# Altium schematic sheet PreCharge.SchDoc: MSXII - PreCharge and Discharge controller
size Legal; DrawnBy: Taiping Li
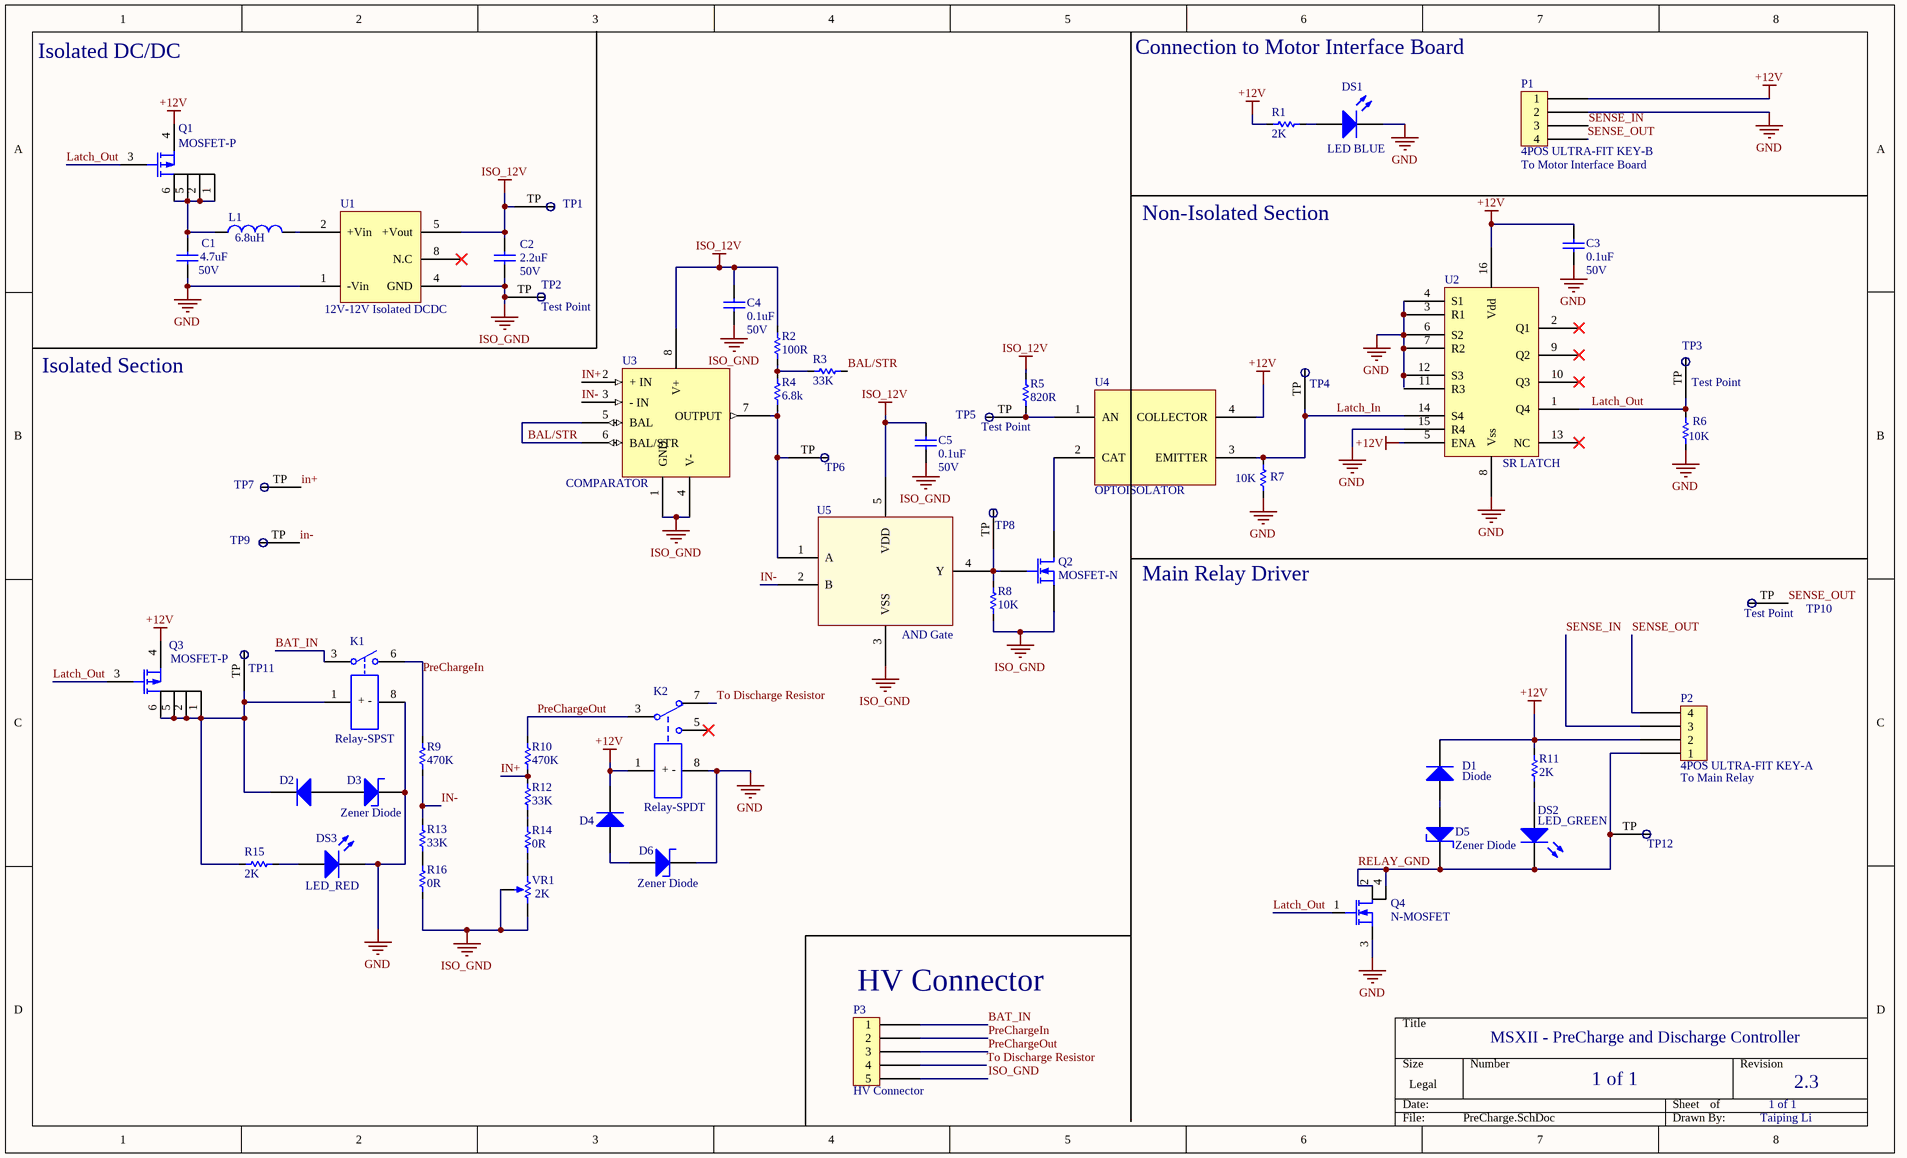
[diagram p0: PreCharge.SchDoc]

## Parts
C1  4.7uF  Voltage: 50V  [0805]
C2  2.2uF  Voltage: 50V  [CAPC1608X06N]
C3  0.1uF  Voltage: 50V  [CAPC1608X06N]
C4  0.1uF  Voltage: 50V  [CAPC1608X06N]
C5  0.1uF  Voltage: 50V  [CAPC1608X06N]
D1  Diode  [DO-214AA Diode]
D2  Diode  [DO-214AA Diode]  (value not drawn)
D3  Zener Diode  [DO-214AA Diode]
D4  Diode  [DO-214AA Diode]  (value not drawn)
D5  Zener Diode  [DO-214AA Diode]
D6  Zener Diode  [DO-214AA Diode]
DS1  LED BLUE  [LED_0603]
DS2  LED_GREEN  [LED_0603]
DS3  LED_RED  [LED_0603]
K1  Relay-SPST  [RELAY-SPST]
K2  Relay-SPDT  [RELAY_SPDT]
L1  6.8uH  [NLFV32T-6R8M-EF/IND 6.8uH]
P1  4POS ULTRA-FIT KEY-B  [4 POS ULTRA-FIT]
P2  4POS ULTRA-FIT KEY-A  [4 POS ULTRA-FIT]
P3  HV Connector  [5 POS ULTRA-FIT]
Q1  MOSFET-P  [P-MOSFET]
Q2  MOSFET-N  [N-CH MOSFET SOT-23]
Q3  MOSFET-P  [P-MOSFET]
Q4  N-MOSFET  [BUK9880 N-MOSFET 7A]
R1  2K  [RES_0603]
R2  100R  [RESC1608X06N]
R3  33K  [RESC1608X06N]
R4  6.8k  [RESC1608X06N]
R5  value 820R  [RESC1608X06N]  (hidden comment: 820 Ohm)
R6  10K  [RES_0603]
R7  10K  [RES_0603]
R8  10K  [RESC1608X06N]
R9  470K  [RES_0603]
R10  470K  [RES_0603]
R11  2K  [RES_0603]
R12  33K  [RES_0603]
R13  33K  [RES_0603]
R14  0R  [RESC1608X06N]
R15  2K  [RES_0603]
R16  0R  [RESC1608X06N]
TP1  Test Point  [Test Point]  (value not drawn)
TP2  Test Point  [Test Point]
TP3  Test Point  [Test Point]
TP4  Test Point  [Test Point]  (value not drawn)
TP5  Test Point  [Test Point]
TP6  Test Point  [Test Point]  (value not drawn)
TP7  Test Point  [Test Point]  (value not drawn)
TP8  Test Point  [Test Point]  (value not drawn)
TP9  Test Point  [Test Point]  (value not drawn)
TP10  Test Point  [Test Point]
TP11  Test Point  [Test Point]  (value not drawn)
TP12  Test Point  [Test Point]  (value not drawn)
U1  12V-12V Isolated DCDC  [1470-2950-1-ND/Isolated DCDC]
U2  SR LATCH  [CD4043BDR-16SOIC]
U3  COMPARATOR  [SOIC8]
U4  OPTOISOLATOR  [FOD817DS OPTOISOLATOR]
U5  AND Gate  [2-Input AND Gate]
VR1  value 2K  [20K POT]  (hidden comment: 2k 0.25W Pot)

## Nets
+12V: C3.2 D1.2(K) D4.2(K) K2.1(+) P1.1 P2.2 Q1.4(S) Q3.4(S) R1.2 R11.1 U2.5(ENA) U2.16(Vdd) U4.4(COLLECTOR)
GND: C1.1 C3.1 D3.2(K) D6.2(K) DS1.2(K) DS3.2(K) K1.8(-) K2.8(-) P1.2 Q4.3(S) R6.1 R7.1 U1.1(-Vin) U2.3(R1) U2.4(S1) U2.6(S2) U2.7(R2) U2.8(Vss) U2.12(S3) U2.15(R4)
ISO_12V: C2.2 C4.2 C5.2 R2.2 R5.2 TP1.TP U1.5(+Vout) U3.8(V+) U5.5(VDD)
ISO_GND: C2.1 C4.1 C5.1 P3.5 Q2.2(S) R8.1 R16.1 TP2.TP U1.4(GND) U3.1(GND) U3.4(V-) U5.3(VSS) VR1.2(TAP) VR1.3(BOT)
BAL/STR: R3.2 U3.5(BAL) U3.6(BAL/STR)
BAT_IN: K1.3 P3.1
in+: R10.1 R12.2 TP7.TP U3.2(+_IN)
in-: R9.1 R13.2 TP9.TP U3.3(-_IN) U5.2(B)
Latch_In: R7.2 TP4.TP U2.14(S4) U4.3(EMITTER)
Latch_Out: Q1.3(G) Q3.3(G) Q4.1(G) R6.2 TP3.TP U2.1(Q4)
PreChargeIn: K1.6 P3.2 R9.2
PreChargeOut: K2.3 P3.3 R10.2
RELAY_GND: D5.2(K) DS2.2(K) P2.1 Q4.2(D) Q4.4 TP12.TP
SENSE_IN: P1.3 P2.3
SENSE_OUT: P1.4 P2.4 TP10.TP
To Discharge Resistor: K2.7 P3.4
NetC1_2: C1.2 L1.1 Q1.1(D) Q1.2(D) Q1.5(D) Q1.6(D)
NetD1_1: D1.1(A) D5.1(A)
NetD2_1: D2.1(A) D3.1(A)
NetD2_2: D2.2(K) K1.1(+) Q3.1(D) Q3.2(D) Q3.5(D) Q3.6(D) R15.1 TP11.TP
NetD4_1: D4.1(A) D6.1(A)
NetDS1_1: DS1.1(A) R1.1
NetDS2_1: DS2.1(A) R11.2
NetDS3_1: DS3.1(A) R15.2
NetL1_2: L1.2 U1.2(+Vin)
NetQ2_1: Q2.1(G) R8.2 TP8.TP U5.4(Y)
NetQ2_3: Q2.3(D) U4.2(CAT)
NetR2_1: R2.1 R3.1 R4.2
NetR4_1: R4.1 TP6.TP U3.7(OUTPUT) U5.1(A)
NetR5_1: R5.1 TP5.TP U4.1(AN)
NetR12_1: R12.1 R14.2
NetR13_1: R13.1 R16.2
NetR14_1: R14.1 VR1.1(TOP)

Not connected (* = marked no-connect by the designer): K2 5*; U1 8(N.C)*; U2 2(Q1)* 9(Q2)* 10(Q3)* 11(R3) 13(NC)*

## Notes on the sheet
- Isolated DC/DC
- Connection to Motor Interface Board
- (near P1) To Motor Interface Board
- Non-Isolated Section
- Isolated Section
- Main Relay Driver
- (near P2) To Main Relay
- (near P3) HV Connector
- MSXII - PreCharge and Discharge Controller
- 1 of 1
- 2.3
- (in symbol Relay-SPDT) + -
- (in symbol Relay-SPST) + -

## Library data of the parts
C1 = CAP CER 4.7UF 25V 10% X5R 0603: 4.7µF ±10% 50V Ceramic Capacitor X5R 0805 (2012 Metric); Manufacturer: Murata Electronics North America; ManufacturerPartNumber: GRM188R61E475KE11D; Value: 4.7uF; Supplier 1: Digi-Key; Supplier 1 Part Number: CAP CER 4.7UF 50V X5R 0805
C2 = CAP CER 2.2UF 25V 10% 0603: CAP CER 2.2UF 50V X5R 0603; ManufacturerPartNumber: GRM188R61H225KE11D; Manufacturer: Murata Electronics North America; Supplier 1: Digi-Key; Value: 2.2uF; Supplier 1 Part Number: 490-10733-1-ND
C3-C5 = CAP CER 0.1UF 50V 10% X7R 0603: 0.10µF ±10% 50V Ceramic Capacitor X7R 0603 (1608 Metric); Manufacturer: AVX Corporation; ManufacturerPartNumber: 06035C104KAT2A; Value: 0.1uF; Supplier: Digi-Key; SupplierPartNumber: 478-5052-1-ND
D1 D2 D4 = Diode: Diode Schottky 40V 3A Surface Mount DO-214AA (SMB); Manufacture: Comchip Technology; Manufacture Part Number: CDBB340-HF; Voltage - Zener (Nom): 40; Voltage - Forward: 500mV @ 3A; Supplier 1: Digi-Key; Supplier Part Number 1: 641-1722-1-ND
D3 D5 D6 = Zener Diode: Zener Diode 16V 5W ±5% Surface Mount DO-214AA (SMB); Manufacture: Micro Commercial Co; Manufacture Part Number: SMBJ5353B-TP; Impedence (Max): 2.5 Ohm; Voltage - Forward: 1.2V @ 1A; Voltage - Zener (Nom): 16V; Power (Max): 5W; Supplier 1: Digi-Key; Supplier Part Number 1: SMBJ5353B-TPMSCT-ND
DS1 = LED_BLUE: LED BLUE CLEAR 0603 SMD; Manufacturer: Lite-On Inc.; Manufacturer Part Number: LTST-C193TBKT-5A; Forward Voltage: 2.8V; DC Foward Current: 20mA; Supplier 1 Part Number: 160-1827-1-ND; Color: Blue
DS2 = LED_GREEN: LED GREEN CLEAR 0603 SMD; Manufacturer: Lite-On Inc.; Manufacturer Part Number: LTST-C193KGKT-5A; Forward Voltage: 2.0V; DC Forward Current: 30mA; Package: 0603; Color: Green; Supplier 1: Digi-Key; Supplier 1 Part Number: 160-1828-1-ND
DS3 = LED_RED: Red LED 0603; Manufacture: Lite-On Inc.; Manufacture Part Number: LTST-C191KRKT; Forward Voltage: 2.0V; DC Forward Current: 30mA; Package: 0603; Color: Red; Supplier 1: Digi-Key; Supplier Part Number 1: 160-1447-1-ND
K1 = Relay-SPST: Telecom Relay SPST-NO (1 Form A) Surface Mount; Manufacture: TE Connectivity Potter & Brumfield Relays; Manufacture Part Number: 1462041-3; Coil Type: 11.7mA; Coil Voltage: 12VDC; Contact Rating: 2A; Switching Voltage: 250VAC, 220VDC - Max; Operate Time: 3ms; Contact Form: SPST-NO; Supplier 1: Digi-Key; Supplier Part Number 1: PB1248CT-ND
K2 = Relay-SPDT: Telecom Relay SPDT (1 Form C) Surface Mount; Manufacturer Part Number: 1462042-9; Coil Type: Non Latching; Switching Voltage: 250VAC, 220VDC; Operate Time: 3ms; Coil Power: 140 mW; Coil Voltage: 12V; Contact Form: SPDT; Supplier 1: Digi-Key; Supplier Part Number 1: PB1250CT-ND
L1 = IND 6.8uH: 6.8µH Shielded Wirewound Inductor 260mA 204 mOhm Max 1210 (3225 Metric); Manufacturer: TDK Corporation; Manufacturer Part Number: NLFV32T-6R8M-EF; Supplier 1: Digi-Key; Supplier Part Number 1: 445-15776-1-ND; Current Rating: 260mA; DC Resistance (DCR): 204 mOhm Max
P1 = 4 Position Vertical Ultra-Fit: 4 Positions Header Connector 0.138" (3.50mm) Through Hole Tin; Manufacture: Molex LLC; Manufacture Part Number: 1722872104; Supplier 1: Digi-Key; Supplier Part Number 1: WM11724-ND
P2 = 4 Position Vertical Ultra-Fit: 4 Positions Header Connector 0.138" (3.50mm) Through Hole Tin; Manufacture: Molex LLC; Manufacture Part Number: 1722871104; Supplier 1: Digi-Key; Supplier Part Number 1: WM11703-ND
P3 = 5 Position Vertical Ultra-Fit: 5 Positions Header Connector 0.138" (3.50mm) Through Hole Tin; Manufacture Part Number: 1722871105; Manufacture: Molex LLC; Supplier 1: Digi-Key; Supplier Part Number 1: WM11704-ND
Q1 Q3 = MOSFET-P: MOSFET P-CH 30V 4A SOT23-6; Vendor Part Number: 497-15521-1-ND; Manufacture: STMicroelectronics; Manufacture Part Number: STT4P3LLH6; Vendor: Digi-Key; Current - Cont Drain: 4A (Ta); FET Type: MOSFET P-Channel, Metal Oxide; Drain to Source Voltage (Vdss): 30V; Package: SOT-23-6; Supplier 1: Digi-Key; Supplier Part Number 1: 497-15521-1-ND
Q2 = MOSFET-N: MOSFET N-CH 50V 200MA SOT23-3; Manufacture: Diodes Incorporated; Manufacture Part Number: BSS138-7-F; Vendor Part Number: 497-3177-1-ND; Vendor: Digi-Key; Supplier 1: Digi-Key; Supplier Part Number 1: BSS138-FDICT-ND
Q4 = MOSFET-N High Current: MOSFET N-CH 55V 7A SOT223; Manufacture: Nexperia USA Inc.; Manufacture Part Number: BUK9880-55A/CUX; Vgs: +-15V; Rds On (Max) @ Id, Vgs: 73 mOhm @ 8A, 10V; Drain to Source Voltage (Vdss): 55V; Supplier 1: Digi-Key; Supplier Part Number 1: 1727-2230-1-ND
R1 R11 R15 = RES SMD 820 OHM 5% 1/4W 0603: Manufacture: Panasonic Electronic Components; Manufacture Part Number: ERJ-3EKF2001V; Tolerence: 1%; Power: 1/10W; Package: 0603; Supplier 1: Digi-Key; Supplier Part Number 1: P2.00KHCT-ND; Value: 2K
R2 = RES 6.8k OHM 1% 1/10W 0603 SMD: RES SMD 100 OHM 1% 1/10W 0603; ManufacturerPartNumber: RC0603FR-07100RL; Manufacturer: Yageo; Value: 100R; Supplier 1: Digi-Key; Supplier 1 Part Number: 311-100HRCT-ND
R3 R12 R13 = RES 33K OHM 1% 1/4W 0603: Manufacture: Panasonic Electronic Components; Manufacture Part Number: ERJ-PA3F3302V; Vendor Part Number: P47KBYCT-ND; Vendor: Digi-Key; Power: 0.25W; Tolerence: 1%; Package: 0603; Value: 33K; Supplier 1: Digi-Key
  R12 R13: Supplier Part Number 1: P33KBYCT-ND
R4 = RES 6.8k OHM 1% 1/10W 0603 SMD: RES SMD 6.8K OHM 1% 1/10W 0603; ManufacturerPartNumber: RMCF0603FT6K80; Manufacturer: Stackpole Electronics Inc.; Value: 6.8k; Supplier: Digi-Key; Supplier Part Number: RMCF0603FT6K80CT-ND
R5 = RES SMD 820 OHM 5% 1/4W 0603: Manufacture: Rohm Semiconductor; Manufacture Part Number: ESR03EZPJ821; Power: 1/10W; Tolerence: 5%; Package: 0603; Supplier 1: Digi-Key; Supplier Part Number 1: RHM820DCT-ND
R6 R7 = RES SMD 10K OHM 1% 1/10W 0603: Manufacture: Yageo; Manufacture Part Number: RC0603FR-0710KL; Vendor Part Number: 311-10.0KHRCT-ND; Vendor: Digi-Key; Tolerence: 1%; Power: 1/10W; Package: 0603; Supplier 1: Digi-Key; Supplier Part Number 1: 311-10.0KHRTR-ND; Value: 10K
R8 = RES SMD 10K OHM 1% 1/10W 0603: Manufacture: Yageo; Manufacture Part Number: RC0603FR-0710KL; Tolerance: 1%; Power: 1/10W; Package: 0603; Supplier: Digi-Key; Supplier Part Number: 311-10.0KHRTR-ND; Value: 10K
R9 R10 = RES 470K OHM 1% 1/4W 0603: RES SMD 470K OHM 1% 1/4W 0603; Manufacture: Panasonic Electronic Components; Manufacture Part Number: ERJ-PA3F4703V; Vendor: Digi-Key; Power: 0.25W; Tolerence: 1%; Package: 0603; Supplier 1: Digi-Key; Value: 470K; Supplier Part Number 1: P470KBYCT-ND
R14 R16 = RES 0.0 OHM 1/4W 0603: RES SMD 0.0 OHM JUMPER 1/4W 0603; Manufacture: Vishay Dale; Manufacture Part Number: CRCW06030000Z0EAHP; Power (W): 0.25; Resistance: 0.0; Supplier 1: Digi-Key; Supplier Part Number 1: 541-0.0SBCT-ND; Package: 0603
U1 = 12V 84mA Isolated DC/DC: Isolated Module DC DC Converter 1 Output 12V 84mA 10.8V - 13.2V Input; Manufacturer Part Number: ISE1212A-TR; Manufacturer: XP Power; Supplier 1: Digi-Key; Supplier Part Number 1: 1470-2950-1-ND
U2 = CD4043B SR Latch: S-R Latch 4 Channel 1:1 IC Tri-State 16-TSSOP; Manufacture: Texas Instruments; Delay Time: 50ns; Supply Voltage: 3-18V; Output Type: Tri-State; Package: 16SOIC; Supplier 1: Digi-Key; Supplier Part Number 1: 296-31496-1-ND
U3 = LM311 Comparator: IC VOLTAGE COMPARATOR 8-SOIC; Manufacture: Texas Instruments; Manufacture Part Number: LM311M/NOPB; Voltage Supply: 5 V ~ 36 V, ±2.5 V ~ 18 V; Output Type: DTL, MOS, Open-Collector, Open-Emitter, RTL, TTL; Supplier 1: Digi-Key; Supplier Part Number 1: LM311MNS/NOPB-ND
U4 = FOD817 Optoisolator: OPTOISOLATOR 5KV TRANSISTOR 4SMD; Manufacture: Fairchild/ON Semiconductor; Manufacture Part Number: FOD817DS; Voltage - Forward: 1.2V Typ; Current Transfer Ratio: 300-600%; Supplier 1: Digi-Key; Supplier Part Number 1: FOD817DS-ND; Output Type: Transistor
U5 = 2-Input AND Gate: IC GATE AND 1CH 2-INP 5-SSOP; Manufacture: Rohm Semiconductor; Manufacture Part Number: BU4S81G2-TR; Voltage - Supply': 3V ~ 16V; Logic Level - Low: 1.5V ~ 4V; Logic Level - High: 3.5V ~ 11V; Supplier 1: Digi-Key; Supplier Part Number 1: BU4S81G2CT-ND
VR1 = 20k 0.25W Pot: TRIMMER 2K OHM 0.25W SMD; Manufacture: TT Electronics/BI; Manufacture Part Number: 23BR2KLFTR; Power: 1/4W; Adjustment Type: Top; Turns: 1; Tolerence: 20%; Supplier 1: Digi-Key; Supplier Part Number 1: 987-1592-1-ND